# Altium schematic sheet Control.SchDoc
size A4
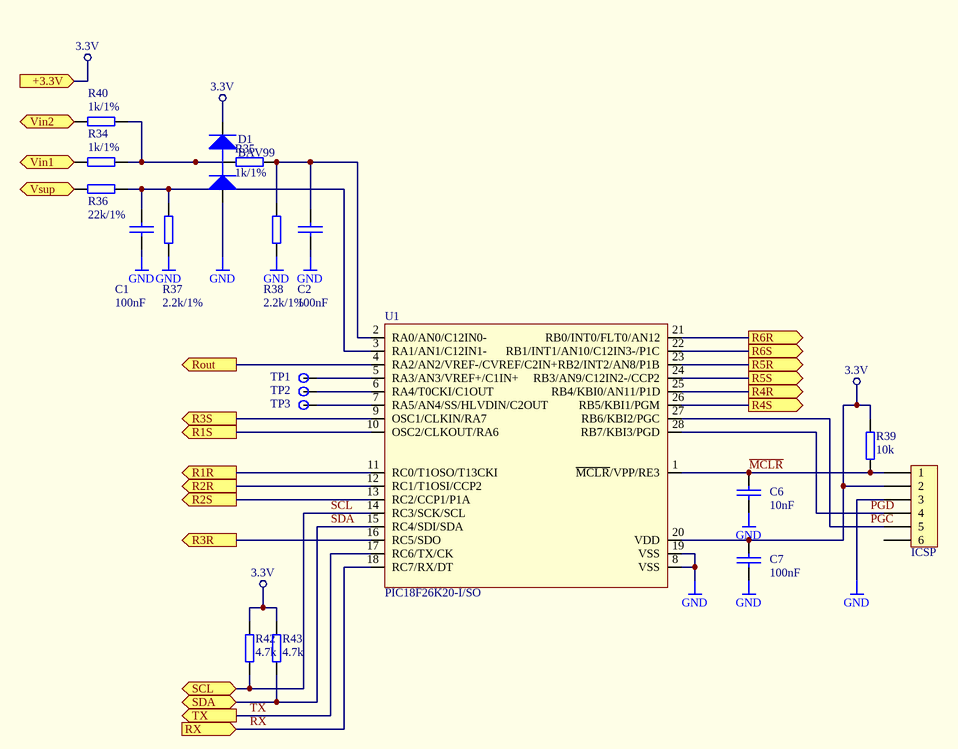
[diagram p0: Control.SchDoc]

## Parts
C1  100nF  [0805_1]
C2  100nF  [0805_1]
C6  10nF  [0805_1]
C7  100nF  [0805_1]
D1  BAV99  [SOT-23]
ICSP  CON6  [JP6]  (value not drawn)
R34  1k/1%  [0805_1]
R35  1k/1%  [0805_1]
R36  22k/1%  [0805_1]
R37  2.2k/1%  [0805_1]
R38  2.2k/1%  [0805_1]
R39  10k  [0805_1]
R40  1k/1%  [0805_1]
R42  4.7k  [0805_1]
R43  4.7k  [0805_1]
TP1  TESTPAD  [PAD-36/65]  (value not drawn)
TP2  TESTPAD  [PAD-36/65]  (value not drawn)
TP3  TESTPAD  [PAD-36/65]  (value not drawn)
U1  PIC18F26K20-I/SO  [SOIC-28]

## Ports
+3.3V (in), R1R (out), R1S (out), R2R (out), R2S (out), R3R (out), R3S (out), R4R (out), R4S (out), R5R (out), R5S (out), R6R (out), R6S (out), Rout (out), RX (in), SCL, SDA, TX (out), Vin1 (in), Vin2 (in), Vsup (in)

## Nets
3.3V: C7.1 D1.2(K) ICSP.2 R39.2 R42.2 R43.2 U1.20(VDD) ; port +3.3V
GND: C1.2 C2.2 C6.2 C7.2 D1.1(A) ICSP.3 R37.1 R38.1 U1.8(VSS) U1.19(VSS)
~{MCLR}: C6.1 ICSP.1 R39.1 U1.1(~{MCLR}/VPP/RE3)
PGC: ICSP.5 U1.27(RB6/KBI2/PGC)
PGD: ICSP.4 U1.28(RB7/KBI3/PGD)
R1R: U1.11(RC0/T1OSO/T13CKI) ; port R1R
R1S: U1.10(OSC2/CLKOUT/RA6) ; port R1S
R2R: U1.12(RC1/T1OSI/CCP2) ; port R2R
R2S: U1.13(RC2/CCP1/P1A) ; port R2S
R3R: U1.16(RC5/SDO) ; port R3R
R3S: U1.9(OSC1/CLKIN/RA7) ; port R3S
R4R: U1.25(RB4/KBI0/AN11/P1D) ; port R4R
R4S: U1.26(RB5/KBI1/PGM) ; port R4S
R5R: U1.23(RB2/INT2/AN8/P1B) ; port R5R
R5S: U1.24(RB3/AN9/C12IN2-/CCP2) ; port R5S
R6R: U1.21(RB0/INT0/FLT0/AN12) ; port R6R
R6S: U1.22(RB1/INT1/AN10/C12IN3-/P1C) ; port R6S
Rout: U1.4(RA2/AN2/VREF-/CVREF/C2IN+) ; port Rout
RX: U1.18(RC7/RX/DT) ; port RX
SCL: R42.1 U1.14(RC3/SCK/SCL) ; port SCL
SDA: R43.1 U1.15(RC4/SDI/SDA) ; port SDA
TX: U1.17(RC6/TX/CK) ; port TX
Vin1: R34.2 ; port Vin1
Vin2: R40.2 ; port Vin2
Vsup: R36.2 ; port Vsup
NetC1_1: C1.1 R36.1 R37.2 U1.3(RA1/AN1/C12IN1-)
NetC2_1: C2.1 R35.1 R38.2 U1.2(RA0/AN0/C12IN0-)
NetD1_3: D1.3(C) R34.1 R35.2 R40.1
NetTP1_1: TP1.1 U1.5(RA3/AN3/VREF+/C1IN+)
NetTP2_1: TP2.1 U1.6(RA4/T0CKI/C1OUT)
NetTP3_1: TP3.1 U1.7(RA5/AN4/SS/HLVDIN/C2OUT)

Not connected (* = marked no-connect by the designer): ICSP 6

## Library data of the parts
C1 C2 C6 C7 = CAP: Capacitor
D1 = BAV99: SOT23 Silicon Planar High-Speed Switching Series Diode Pair; Manufacturer: Zetex; Class: Discrete; SubClass: Diode - Switching; Published: 8/06/2000; Publisher: Altium Hobart Technology Centre
ICSP = CON6: Connector
R34-R40 R42 R43 = RES: Resistor
U1 = PIC18F26K20-I/SO: PIC18 mid-range mcu